# EAGLE schematic dw8e (EAGLE 6.6.0)

## Sheet 1 of 10
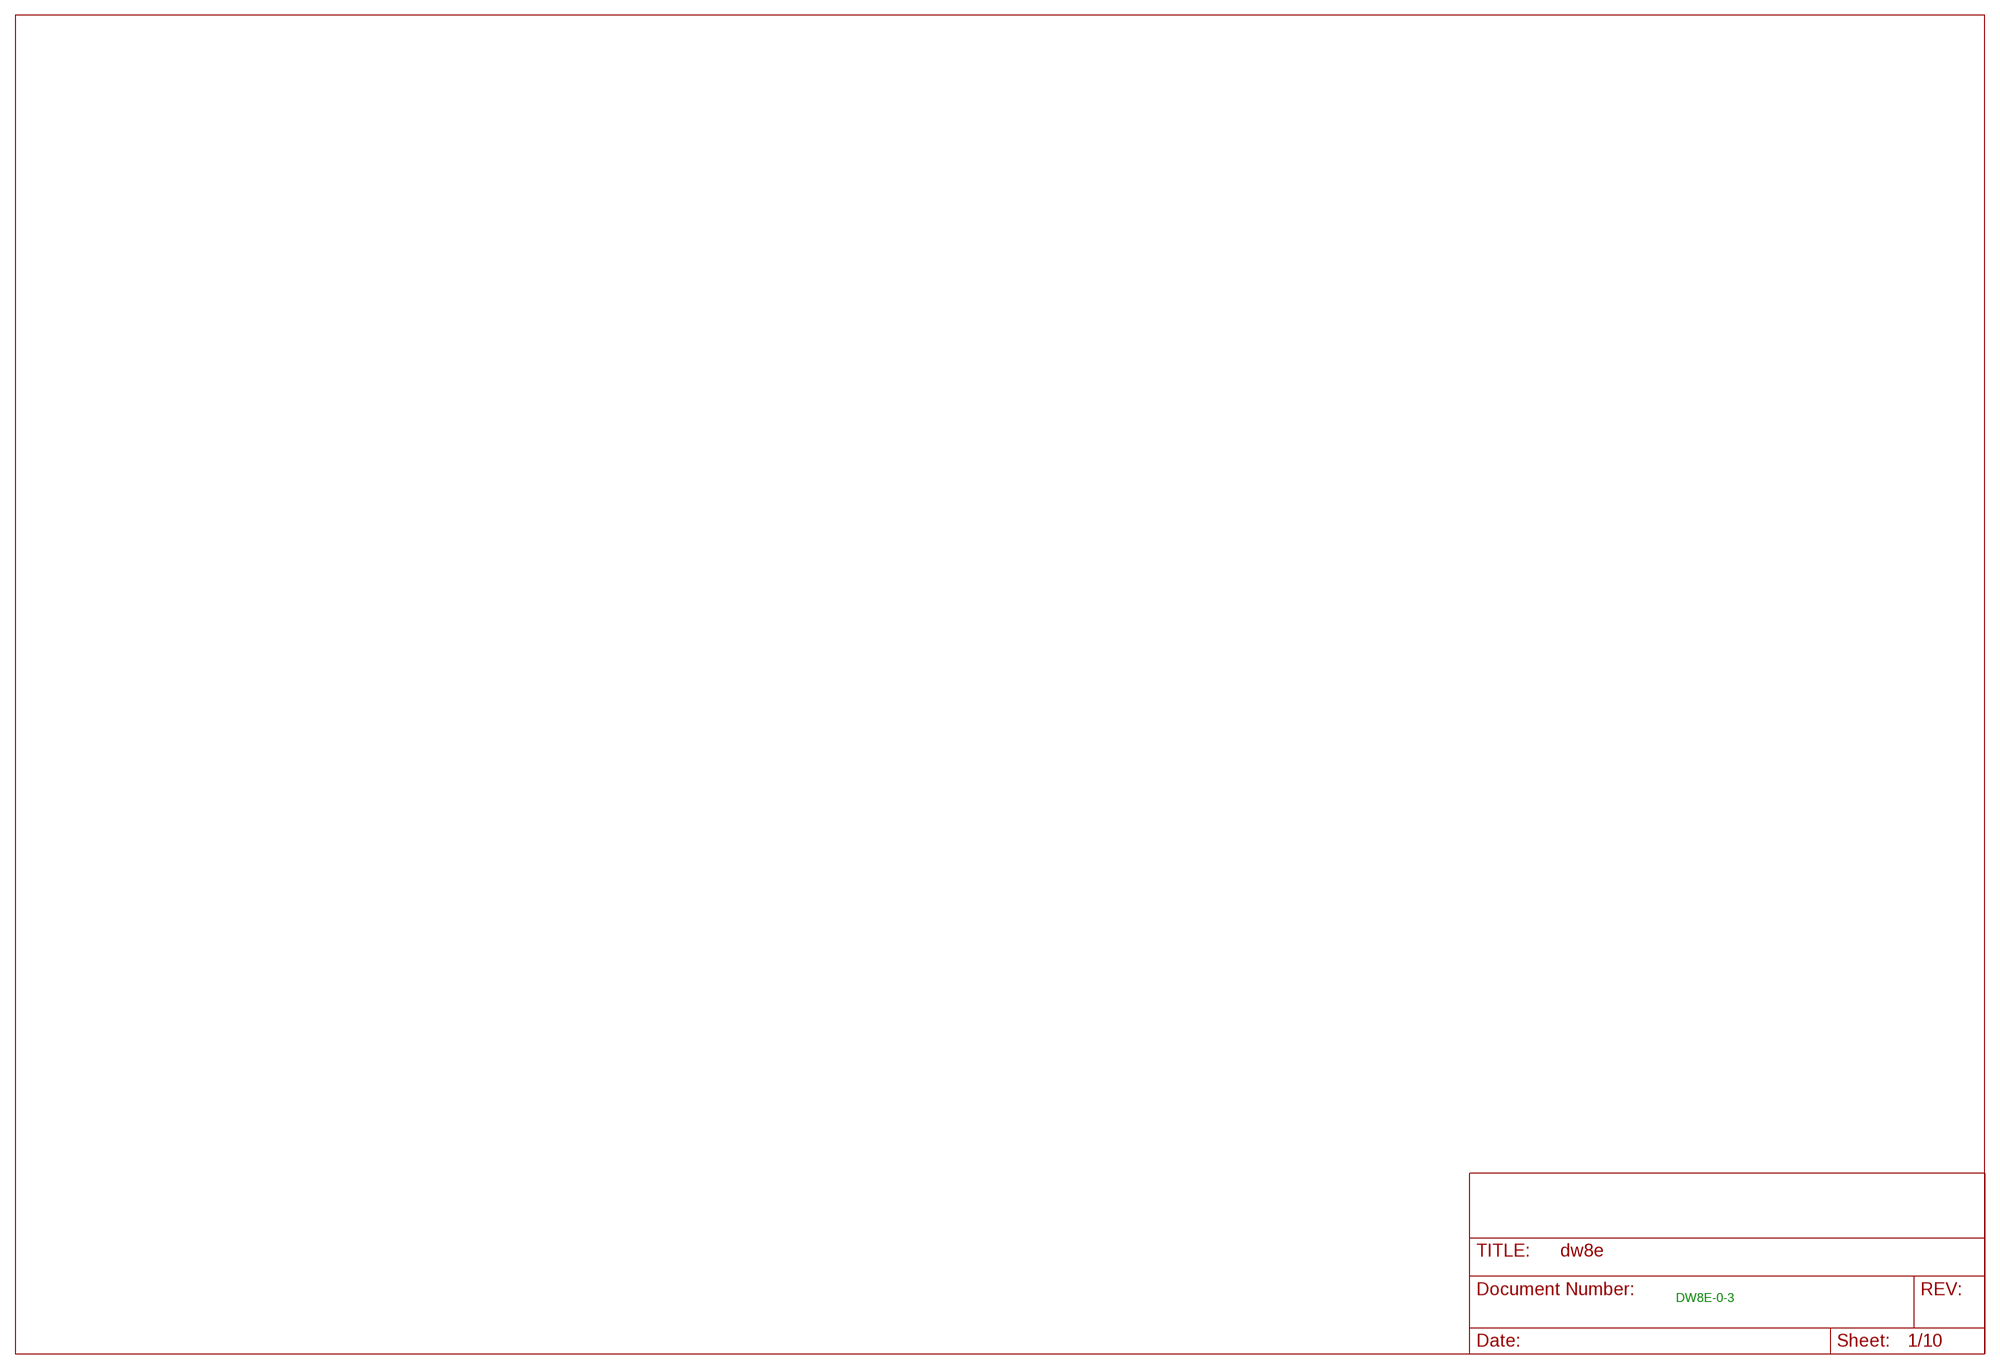
[diagram p0: schematic, sheet 1]

### Notes on the sheet
- DW8E-0-3

## Sheet 2 of 10
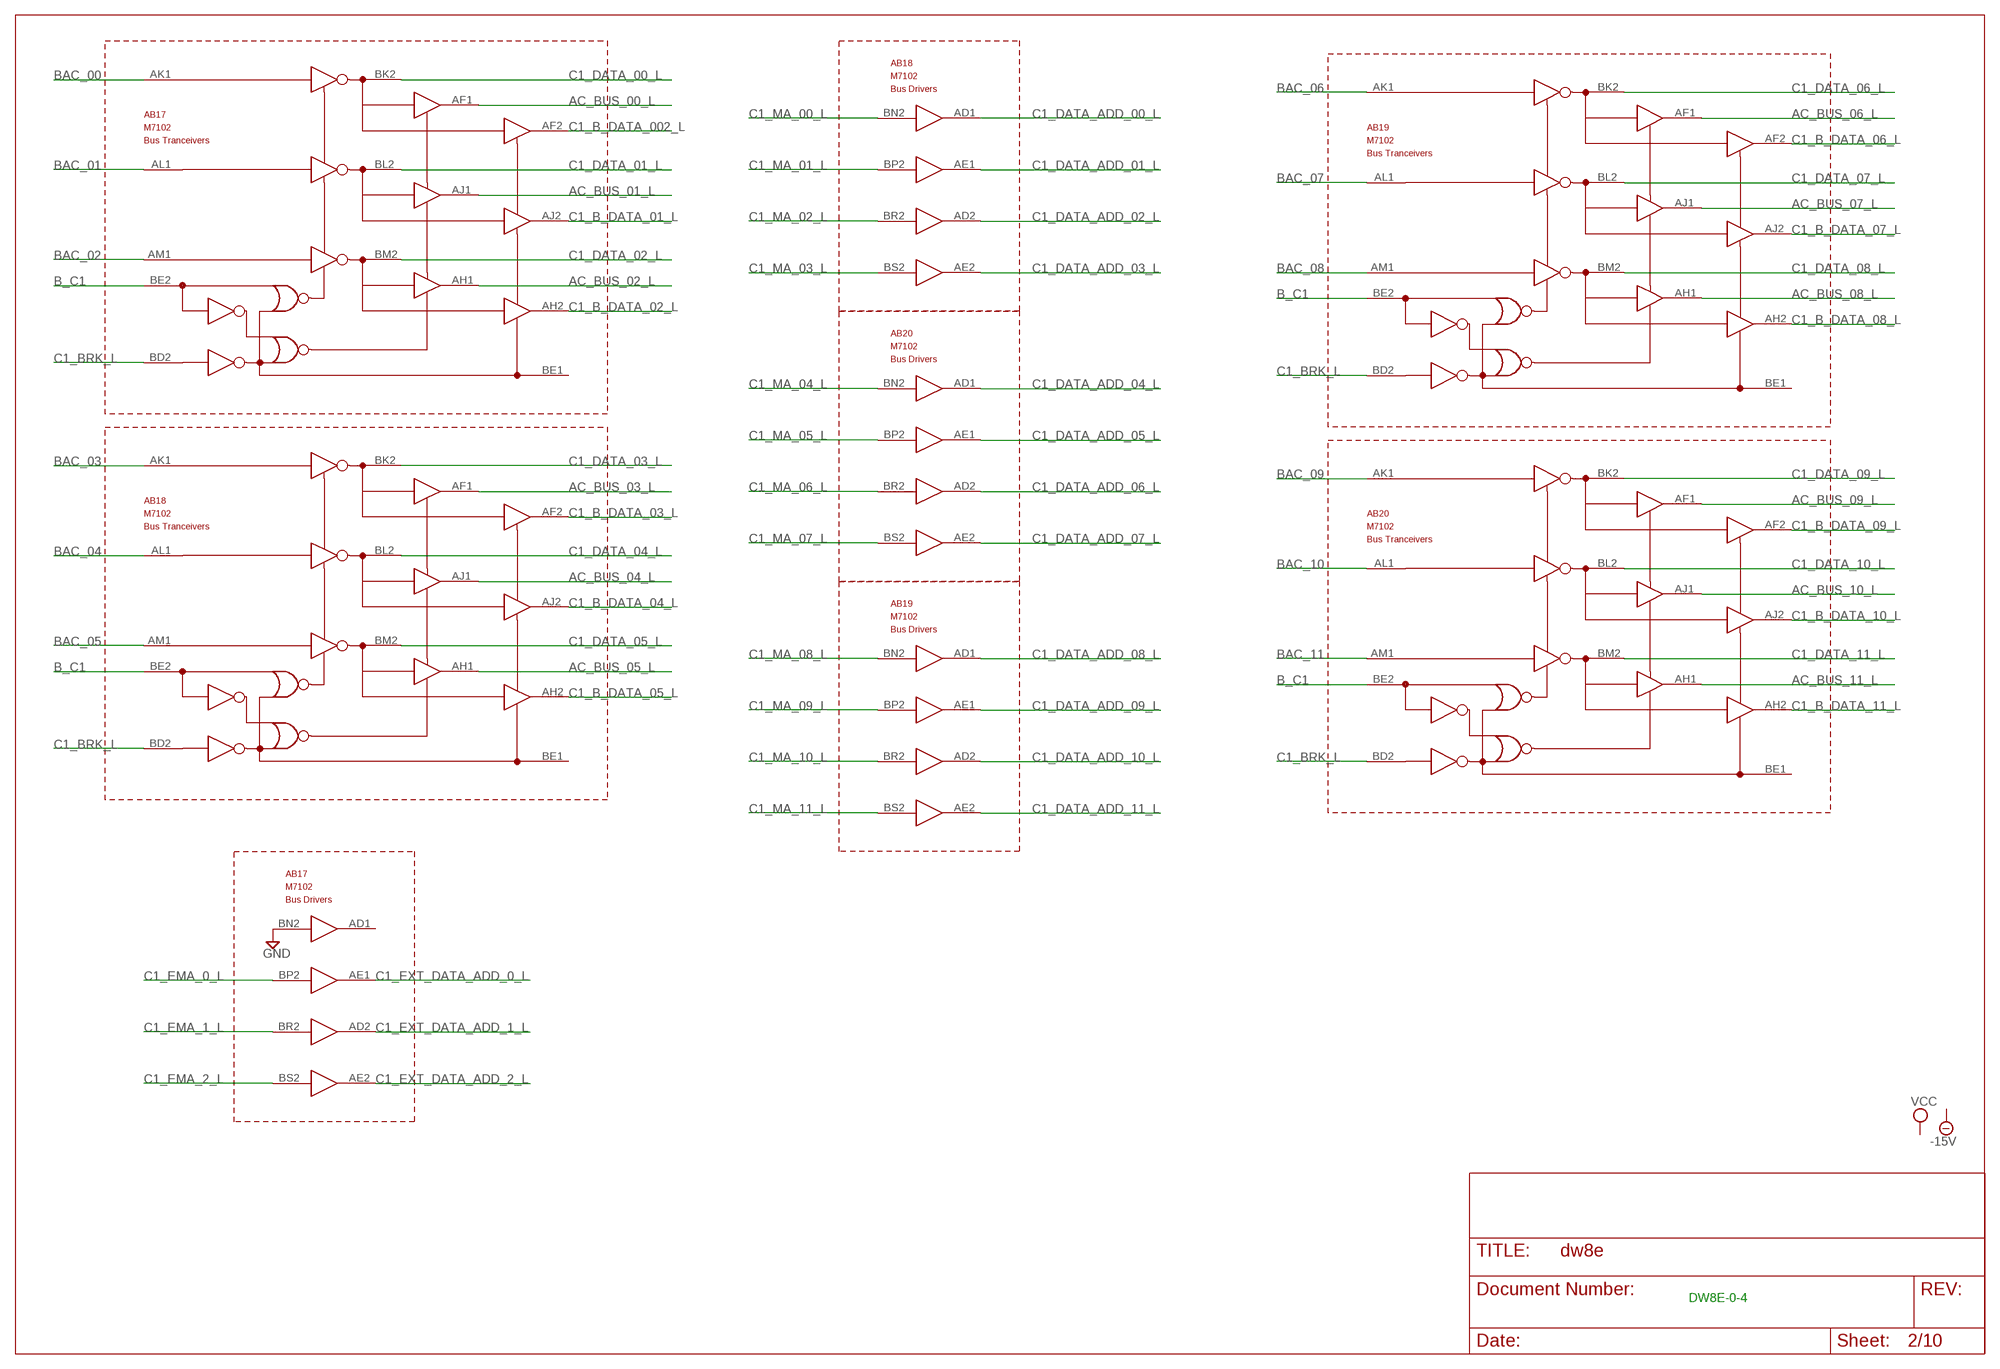
[diagram p1: schematic, sheet 2]

### Parts
AB17  M7102  [H807-2]
AB18  M7102  [H807-2]
AB19  M7102  [H807-2]
AB20  M7102  [H807-2]

### Nets
AC_BUS_00_L: AB17.AF1
AC_BUS_01_L: AB17.AJ1
AC_BUS_02_L: AB17.AH1
AC_BUS_03_L: AB18.AF1
AC_BUS_04_L: AB18.AJ1
AC_BUS_05_L: AB18.AH1
AC_BUS_06_L: AB19.AF1
AC_BUS_07_L: AB19.AJ1
AC_BUS_08_L: AB19.AH1
AC_BUS_09_L: AB20.AF1
AC_BUS_10_L: AB20.AJ1
AC_BUS_11_L: AB20.AH1
B_C1: AB17.BE2 AB18.BE2 AB19.BE2 AB20.BE2
BAC_00: AB17.AK1 ; also sheet 9
BAC_01: AB17.AL1 ; also sheet 9
BAC_02: AB17.AM1 ; also sheet 9
BAC_03: AB18.AK1 ; also sheet 9
BAC_04: AB18.AL1 ; also sheet 9
BAC_05: AB18.AM1 ; also sheet 9
BAC_06: AB19.AK1 ; also sheet 9
BAC_07: AB19.AL1 ; also sheet 9
BAC_08: AB19.AM1 ; also sheet 9
BAC_09: AB20.AK1 ; also sheet 9
BAC_10: AB20.AL1 ; also sheet 9
BAC_11: AB20.AM1 ; also sheet 9
C1_B_DATA_01_L: AB17.AJ2
C1_B_DATA_002_L: AB17.AF2
C1_B_DATA_02_L: AB17.AH2
C1_B_DATA_03_L: AB18.AF2
C1_B_DATA_04_L: AB18.AJ2
C1_B_DATA_05_L: AB18.AH2
C1_B_DATA_06_L: AB19.AF2
C1_B_DATA_07_L: AB19.AJ2
C1_B_DATA_08_L: AB19.AH2
C1_B_DATA_09_L: AB20.AF2
C1_B_DATA_10_L: AB20.AJ2
C1_B_DATA_11_L: AB20.AH2
C1_BRK_L: AB17.BD2 AB18.BD2 AB19.BD2 AB20.BD2 ; also sheet 3
C1_DATA_00_L: AB17.BK2
C1_DATA_01_L: AB17.BL2
C1_DATA_02_L: AB17.BM2
C1_DATA_03_L: AB18.BK2
C1_DATA_04_L: AB18.BL2
C1_DATA_05_L: AB18.BM2
C1_DATA_06_L: AB19.BK2
C1_DATA_07_L: AB19.BL2
C1_DATA_08_L: AB19.BM2
C1_DATA_09_L: AB20.BK2
C1_DATA_10_L: AB20.BL2
C1_DATA_11_L: AB20.BM2
C1_DATA_ADD_00_L: AB18.AD1 ; also sheet 10
C1_DATA_ADD_01_L: AB18.AE1 ; also sheet 10
C1_DATA_ADD_02_L: AB18.AD2 ; also sheet 10
C1_DATA_ADD_03_L: AB18.AE2 ; also sheet 10
C1_DATA_ADD_04_L: AB20.AD1 ; also sheet 10
C1_DATA_ADD_05_L: AB20.AE1 ; also sheet 10
C1_DATA_ADD_06_L: AB20.AD2 ; also sheet 10
C1_DATA_ADD_07_L: AB20.AE2 ; also sheet 10
C1_DATA_ADD_08_L: AB19.AD1 ; also sheet 10
C1_DATA_ADD_09_L: AB19.AE1 ; also sheet 10
C1_DATA_ADD_10_L: AB19.AD2 ; also sheet 10
C1_DATA_ADD_11_L: AB19.AE2 ; also sheet 10
C1_EMA_0_L: AB17.BP2
C1_EMA_1_L: AB17.BR2
C1_EMA_2_L: AB17.BS2
C1_EXT_DATA_ADD_0_L: AB17.AE1 ; also sheet 10
C1_EXT_DATA_ADD_1_L: AB17.AD2 ; also sheet 10
C1_EXT_DATA_ADD_2_L: AB17.AE2 ; also sheet 10
C1_MA_00_L: AB18.BN2
C1_MA_01_L: AB18.BP2
C1_MA_02_L: AB18.BR2
C1_MA_03_L: AB18.BS2
C1_MA_04_L: AB20.BN2
C1_MA_05_L: AB20.BP2
C1_MA_06_L: AB20.BR2
C1_MA_07_L: AB20.BS2
C1_MA_08_L: AB19.BN2
C1_MA_09_L: AB19.BP2
C1_MA_10_L: AB19.BR2
C1_MA_11_L: AB19.BS2
GND: AB17.BN2 ; also sheet 3,4
Unconnected: AB17.AD1 AB17.BE1 AB18.BE1 AB19.BE1 AB20.BE1

### Notes on the sheet
- DW8E-0-4

## Sheet 3 of 10
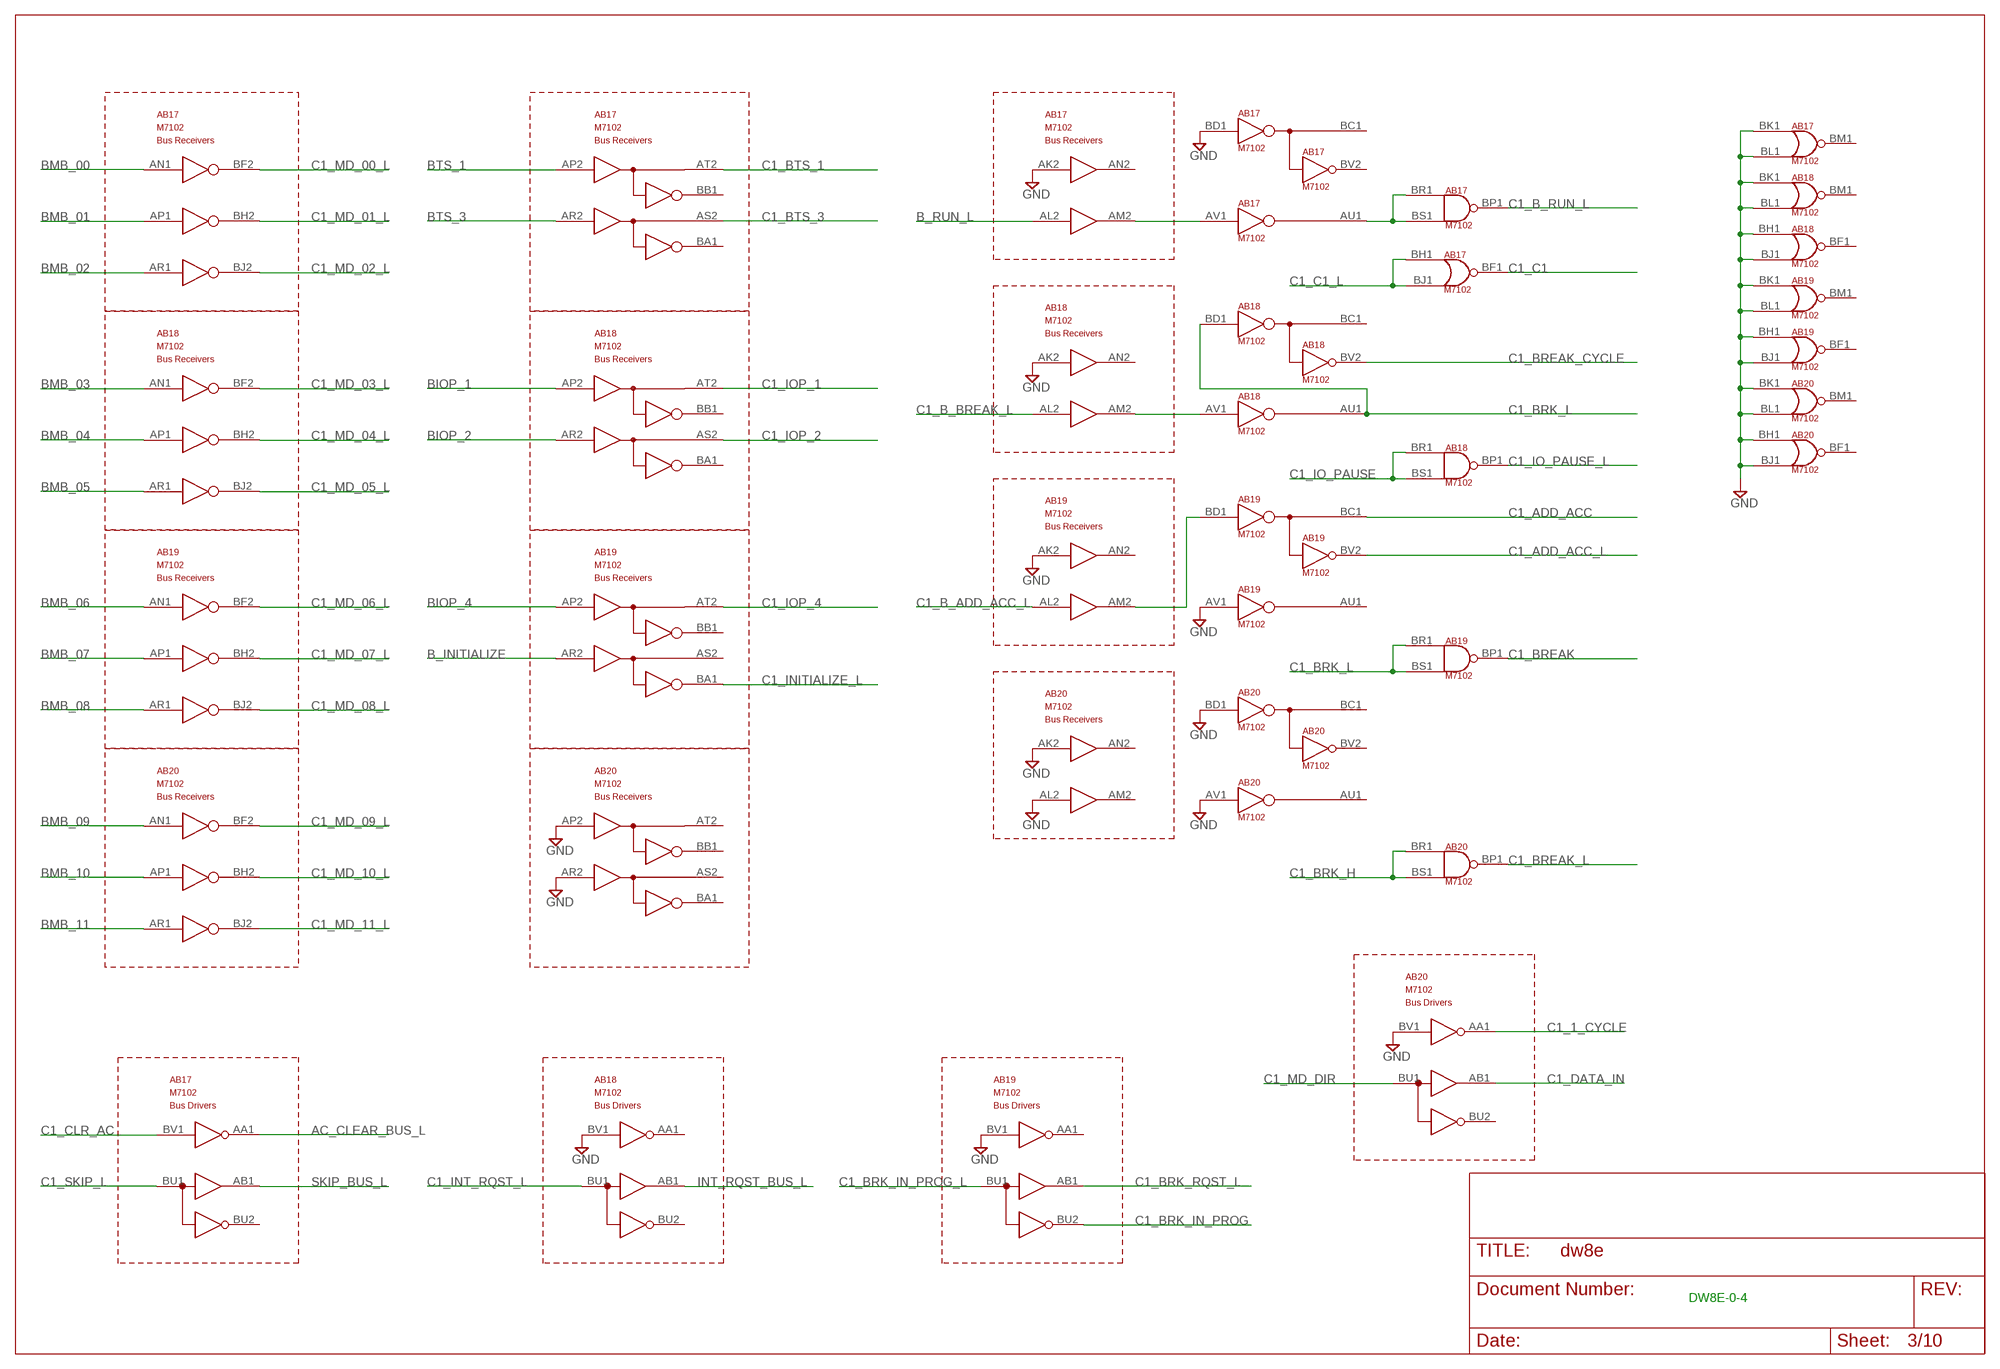
[diagram p2: schematic, sheet 3]

### Nets
AC_CLEAR_BUS_L: AB17.AA1 ; also sheet 9
B_INITIALIZE: AB19.AR2 ; also sheet 9
B_RUN_L: AB17.AL2 ; also sheet 4,9
BIOP_1: AB18.AP2
BIOP_2: AB18.AR2
BIOP_4: AB19.AP2
BMB_00: AB17.AN1 ; also sheet 9
BMB_01: AB17.AP1 ; also sheet 9
BMB_02: AB17.AR1 ; also sheet 9
BMB_03: AB18.AN1 ; also sheet 9
BMB_04: AB18.AP1 ; also sheet 9
BMB_05: AB18.AR1 ; also sheet 9
BMB_06: AB19.AN1 ; also sheet 9
BMB_07: AB19.AP1 ; also sheet 9
BMB_08: AB19.AR1 ; also sheet 9
BMB_09: AB20.AN1 ; also sheet 9
BMB_10: AB20.AP1 ; also sheet 9
BMB_11: AB20.AR1 ; also sheet 9
BTS_1: AB17.AP2 ; also sheet 9
BTS_3: AB17.AR2 ; also sheet 9
C1_1_CYCLE: AB20.AA1 ; also sheet 10
C1_ADD_ACC: AB19.BC1
C1_ADD_ACC_L: AB19.BV2
C1_B_ADD_ACC_L: AB19.AL2
C1_B_BREAK_L: AB18.AL2 ; also sheet 10
C1_B_RUN_L: AB17.BP1(NAND:OUT)
C1_BREAK: AB19.BP1(NAND:OUT)
C1_BREAK_CYCLE: AB18.BV2
C1_BREAK_L: AB20.BP1(NAND:OUT)
C1_BRK_H: AB20.BR1(NAND:IN1) AB20.BS1(NAND:IN2)
C1_BRK_IN_PROG: AB19.BU2
C1_BRK_IN_PROG_L: AB19.BU1
C1_BRK_L: AB18.AU1 AB18.BD1 AB19.BR1(NAND:IN1) AB19.BS1(NAND:IN2) ; also sheet 2
C1_BRK_RQST_L: AB19.AB1 ; also sheet 10
C1_BTS_1: AB17.AT2
C1_BTS_3: AB17.AS2
C1_C1: AB17.BF1(NOR2:OUT)
C1_C1_L: AB17.BH1(NOR2:IN1) AB17.BJ1(NOR2:IN2)
C1_CLR_AC: AB17.BV1
C1_DATA_IN: AB20.AB1 ; also sheet 10
C1_INITIALIZE_L: AB19.BA1
C1_INT_RQST_L: AB18.BU1
C1_IO_PAUSE: AB18.BR1(NAND:IN1) AB18.BS1(NAND:IN2)
C1_IO_PAUSE_L: AB18.BP1(NAND:OUT)
C1_IOP_1: AB18.AT2
C1_IOP_2: AB18.AS2
C1_IOP_4: AB19.AT2
C1_MD_00_L: AB17.BF2
C1_MD_01_L: AB17.BH2
C1_MD_02_L: AB17.BJ2
C1_MD_03_L: AB18.BF2
C1_MD_04_L: AB18.BH2
C1_MD_05_L: AB18.BJ2
C1_MD_06_L: AB19.BF2
C1_MD_07_L: AB19.BH2
C1_MD_08_L: AB19.BJ2
C1_MD_09_L: AB20.BF2
C1_MD_10_L: AB20.BH2
C1_MD_11_L: AB20.BJ2
C1_MD_DIR: AB20.BU1
C1_SKIP_L: AB17.BU1
GND: AB17.AK2 AB17.BD1 AB17.BK1(NOR1:IN1) AB17.BL1(NOR1:IN2) AB18.AK2 AB18.BH1(NOR2:IN1) AB18.BJ1(NOR2:IN2) AB18.BK1(NOR1:IN1) AB18.BL1(NOR1:IN2) AB18.BV1 AB19.AK2 AB19.AV1 AB19.BH1(NOR2:IN1) AB19.BJ1(NOR2:IN2) AB19.BK1(NOR1:IN1) AB19.BL1(NOR1:IN2) AB19.BV1 AB20.AK2 AB20.AL2 AB20.AP2 AB20.AR2 AB20.AV1 AB20.BD1 AB20.BH1(NOR2:IN1) AB20.BJ1(NOR2:IN2) AB20.BK1(NOR1:IN1) AB20.BL1(NOR1:IN2) AB20.BV1 ; also sheet 2,4
INT_RQST_BUS_L: AB18.AB1 ; also sheet 9
N$1: AB17.AU1 AB17.BR1(NAND:IN1) AB17.BS1(NAND:IN2)
N$2: AB19.AM2 AB19.BD1
N$3: AB18.AM2 AB18.AV1
N$4: AB17.AM2 AB17.AV1
SKIP_BUS_L: AB17.AB1 ; also sheet 9
Unconnected: AB17.AN2 AB17.BA1 AB17.BB1 AB17.BC1 AB17.BM1(NOR1:OUT) AB17.BU2 AB17.BV2 AB18.AA1 AB18.AN2 AB18.BA1 AB18.BB1 AB18.BC1 AB18.BF1(NOR2:OUT) AB18.BM1(NOR1:OUT) AB18.BU2 AB19.AA1 AB19.AN2 AB19.AS2 AB19.AU1 AB19.BB1 AB19.BF1(NOR2:OUT) AB19.BM1(NOR1:OUT) AB20.AM2 AB20.AN2 AB20.AS2 AB20.AT2 AB20.AU1 AB20.BA1 AB20.BB1 AB20.BC1 AB20.BF1(NOR2:OUT) AB20.BM1(NOR1:OUT) AB20.BU2 AB20.BV2

### Notes on the sheet
- DW8E-0-4

## Sheet 4 of 10
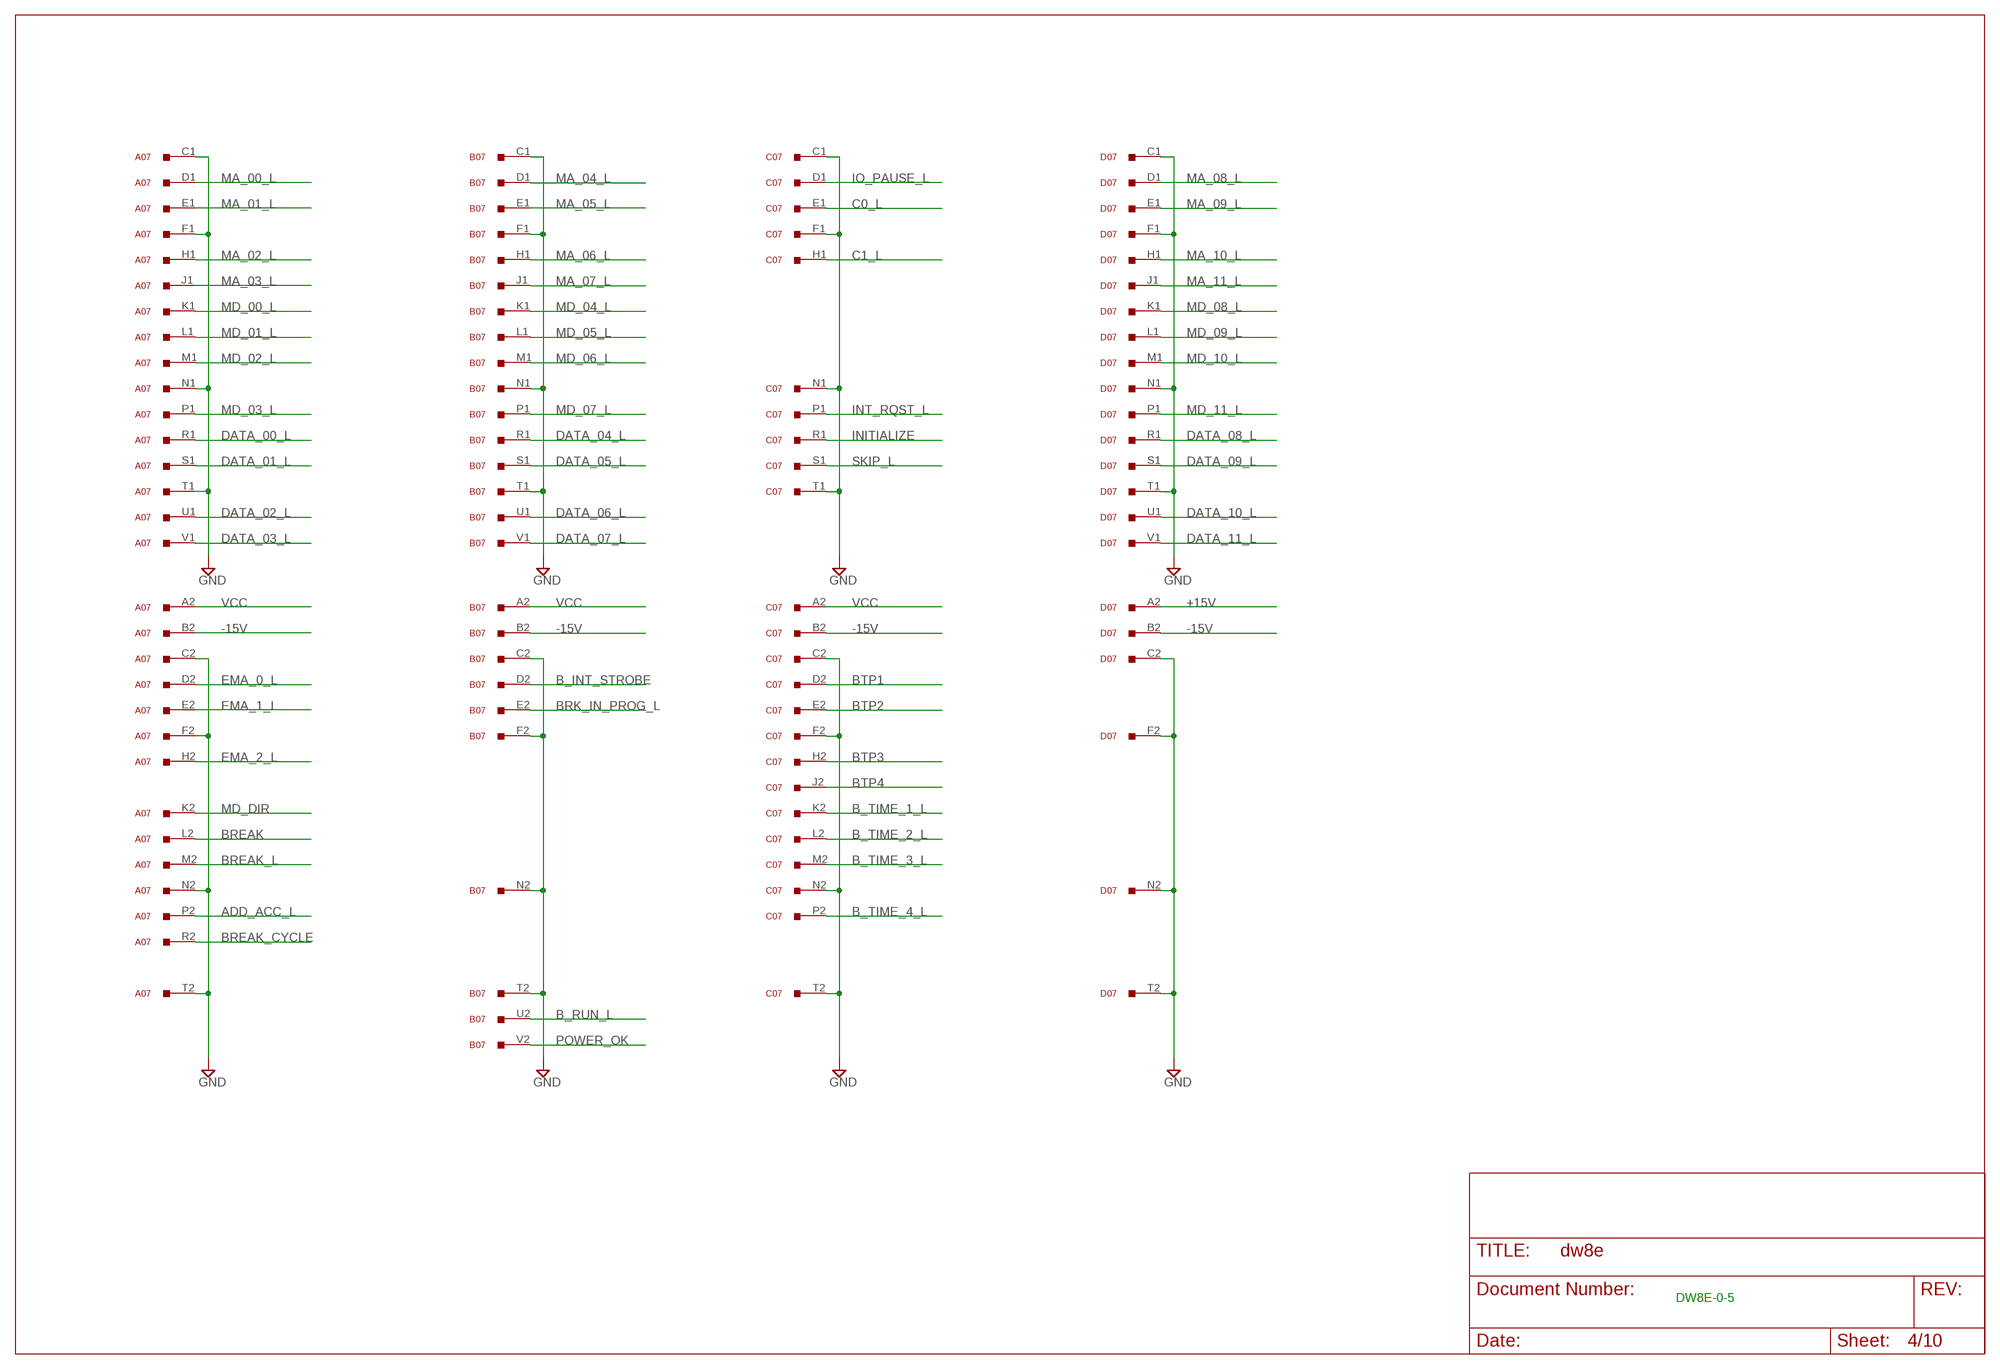
[diagram p3: schematic, sheet 4]

### Parts
A07  M916  [H807]
B07  M916  [H807]
C07  M916  [H807]
D07  M916  [H807]

### Nets
+15V [Supply]: D07.A2
-15V [Supply]: A07.B2 B07.B2 C07.B2 D07.B2
ADD_ACC_L: A07.P2
B_INT_STROBE: B07.D2
B_RUN_L: B07.U2 ; also sheet 3,9
B_TIME_1_L: C07.K2
B_TIME_2_L: C07.L2
B_TIME_3_L: C07.M2
B_TIME_4_L: C07.P2
BREAK: A07.L2
BREAK_CYCLE: A07.R2
BREAK_L: A07.M2
BRK_IN_PROG_L: B07.E2
BTP1: C07.D2
BTP2: C07.E2
BTP3: C07.H2
BTP4: C07.J2
C0_L: C07.E1
C1_L: C07.H1
DATA_00_L: A07.R1
DATA_01_L: A07.S1
DATA_02_L: A07.U1
DATA_03_L: A07.V1
DATA_04_L: B07.R1
DATA_05_L: B07.S1
DATA_06_L: B07.U1
DATA_07_L: B07.V1
DATA_08_L: D07.R1
DATA_09_L: D07.S1
DATA_10_L: D07.U1
DATA_11_L: D07.V1
EMA_0_L: A07.D2
EMA_1_L: A07.E2
EMA_2_L: A07.H2
GND: A07.C1 A07.C2 A07.F1 A07.F2 A07.N1 A07.N2 A07.T1 A07.T2 B07.C1 B07.C2 B07.F1 B07.F2 B07.N1 B07.N2 B07.T1 B07.T2 C07.C1 C07.C2 C07.F1 C07.F2 C07.N1 C07.N2 C07.T1 C07.T2 D07.C1 D07.C2 D07.F1 D07.F2 D07.N1 D07.N2 D07.T1 D07.T2 ; also sheet 2,3
INITIALIZE: C07.R1
INT_RQST_L: C07.P1
IO_PAUSE_L: C07.D1
MA_00_L: A07.D1
MA_01_L: A07.E1
MA_02_L: A07.H1
MA_03_L: A07.J1
MA_04_L: B07.D1
MA_05_L: B07.E1
MA_06_L: B07.H1
MA_07_L: B07.J1
MA_08_L: D07.D1
MA_09_L: D07.E1
MA_10_L: D07.H1
MA_11_L: D07.J1
MD_00_L: A07.K1
MD_01_L: A07.L1
MD_02_L: A07.M1
MD_03_L: A07.P1
MD_04_L: B07.K1
MD_05_L: B07.L1
MD_06_L: B07.M1
MD_07_L: B07.P1
MD_08_L: D07.K1
MD_09_L: D07.L1
MD_10_L: D07.M1
MD_11_L: D07.P1
MD_DIR: A07.K2
POWER_OK: B07.V2
SKIP_L: C07.S1
VCC [Supply]: A07.A2 B07.A2 C07.A2
Unconnected: A07.A1 A07.B1 A07.J2 A07.S2 A07.U2 A07.V2 B07.A1 B07.B1 B07.H2 B07.J2 B07.K2 B07.L2 B07.M2 B07.P2 B07.R2 B07.S2 C07.A1 C07.B1 C07.J1 C07.K1 C07.L1 C07.M1 C07.R2 C07.S2 C07.U1 C07.U2 C07.V1 C07.V2 D07.A1 D07.B1 D07.D2 D07.E2 D07.H2 D07.J2 D07.K2 D07.L2 D07.M2 D07.P2 D07.R2 D07.S2 D07.U2 D07.V2

### Notes on the sheet
- DW8E-0-5

## Sheet 5 of 10
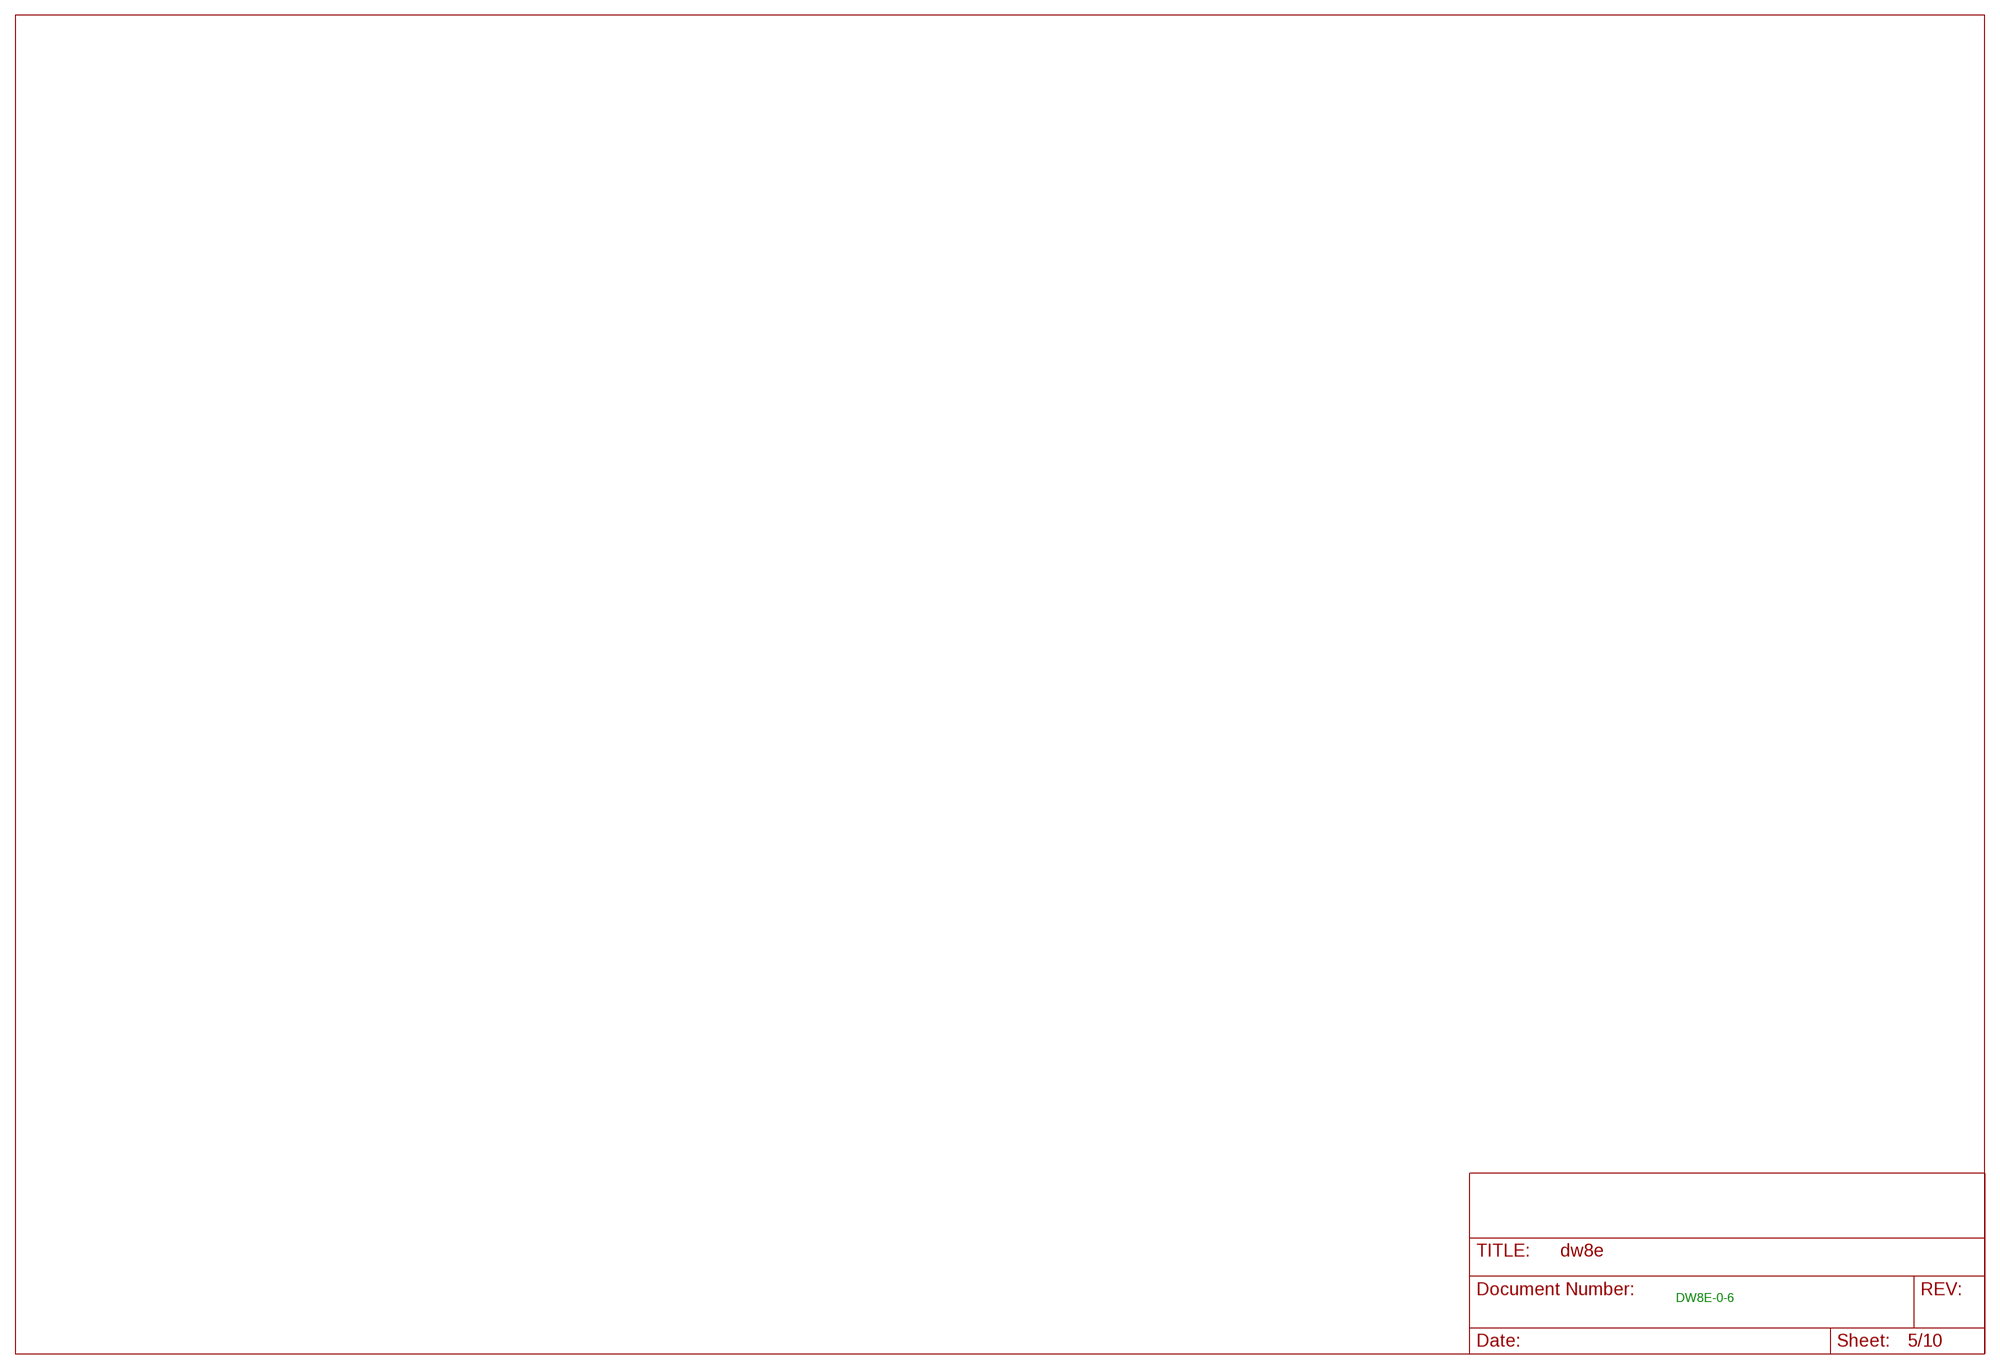
[diagram p4: schematic, sheet 5]

### Notes on the sheet
- DW8E-0-6

## Sheet 6 of 10
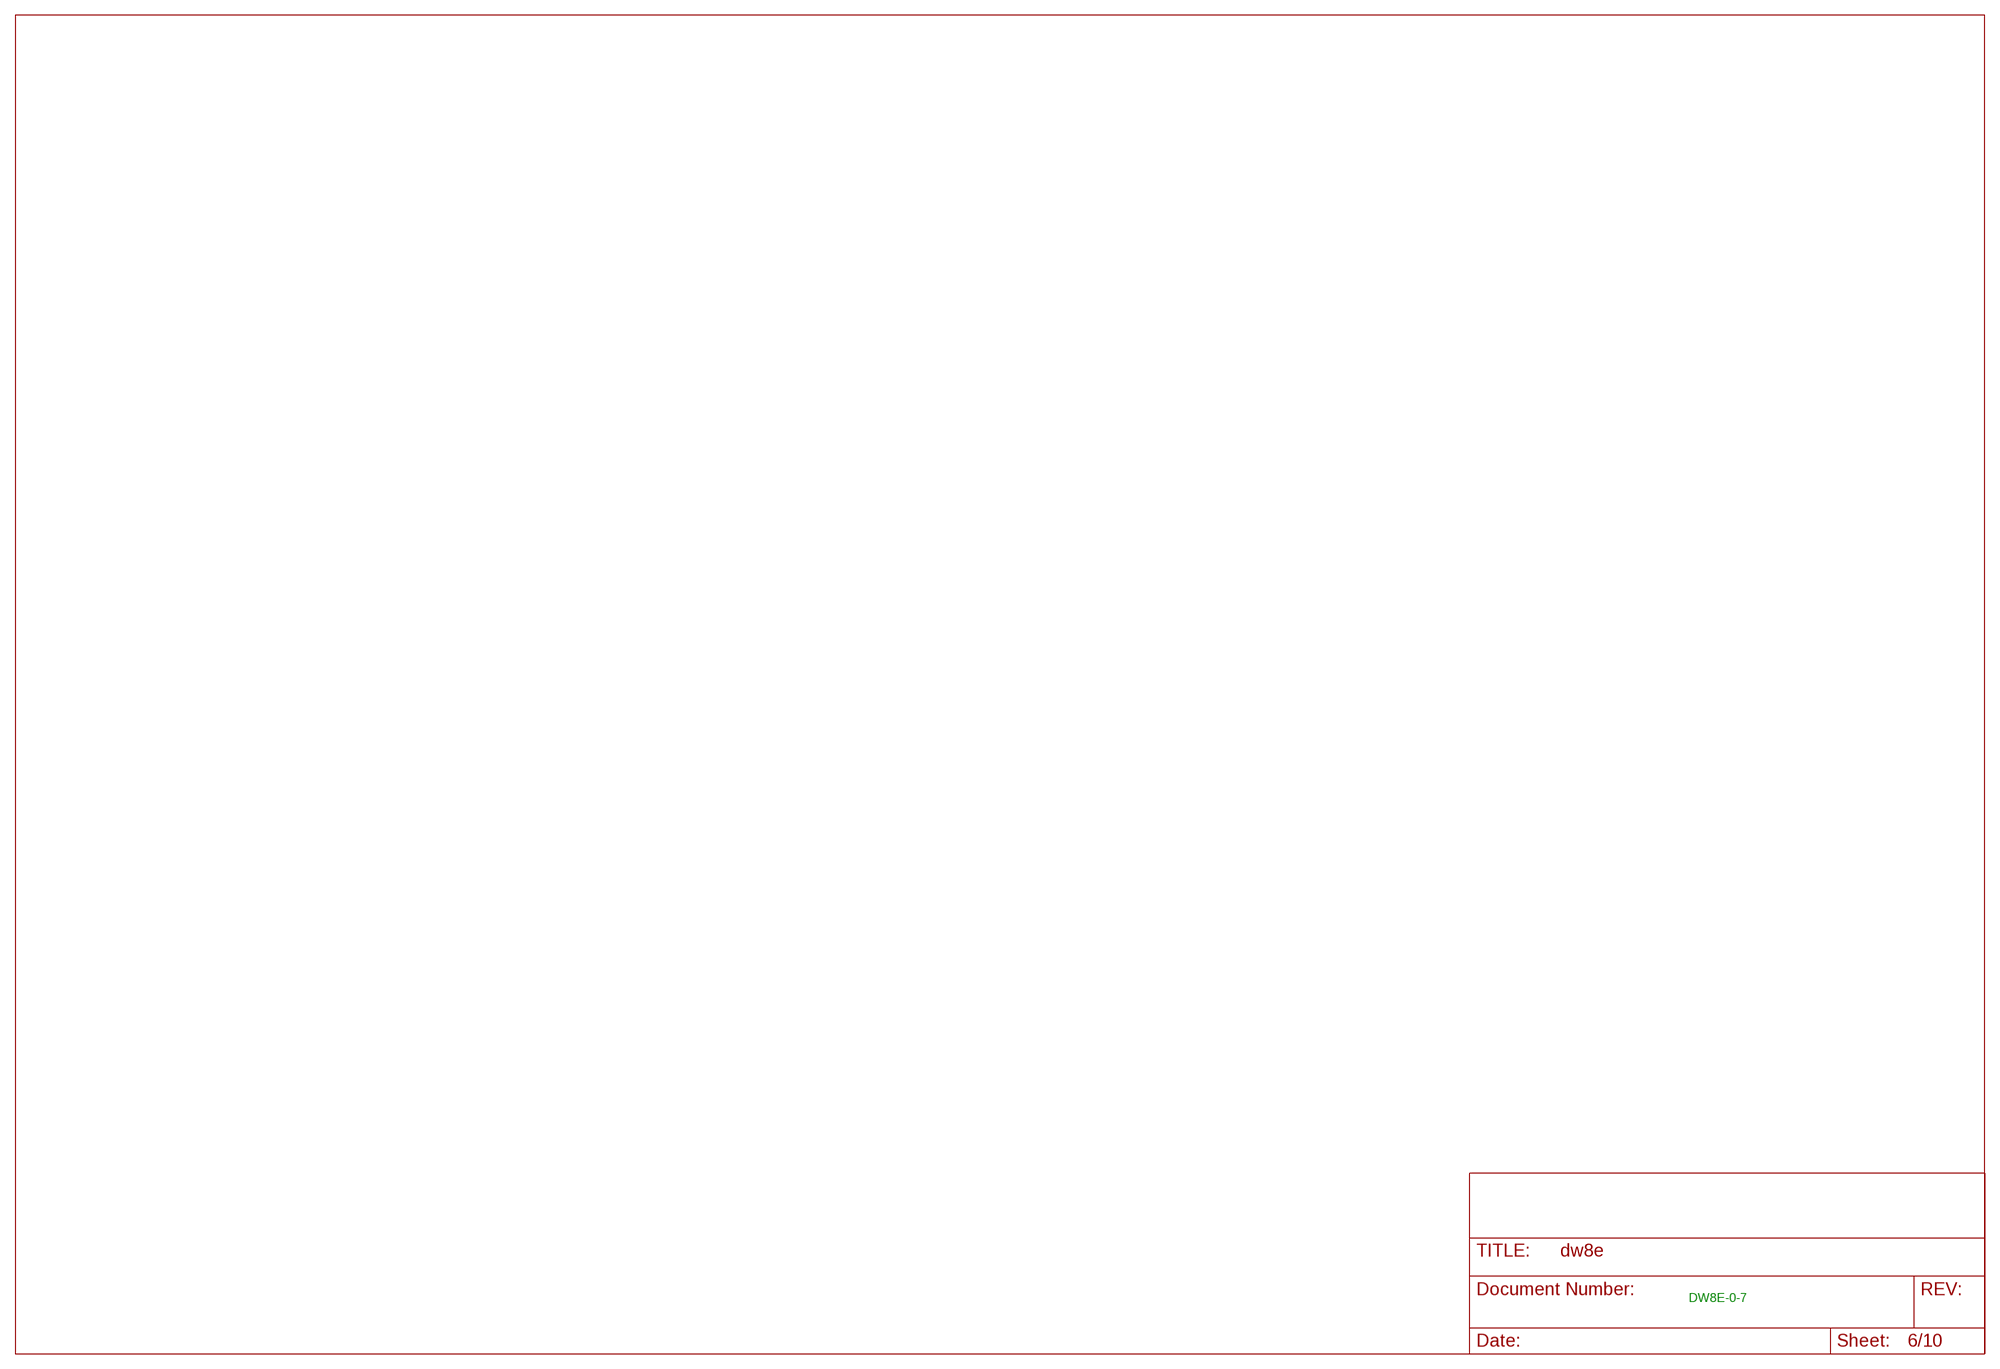
[diagram p5: schematic, sheet 6]

### Notes on the sheet
- DW8E-0-7

## Sheet 7 of 10
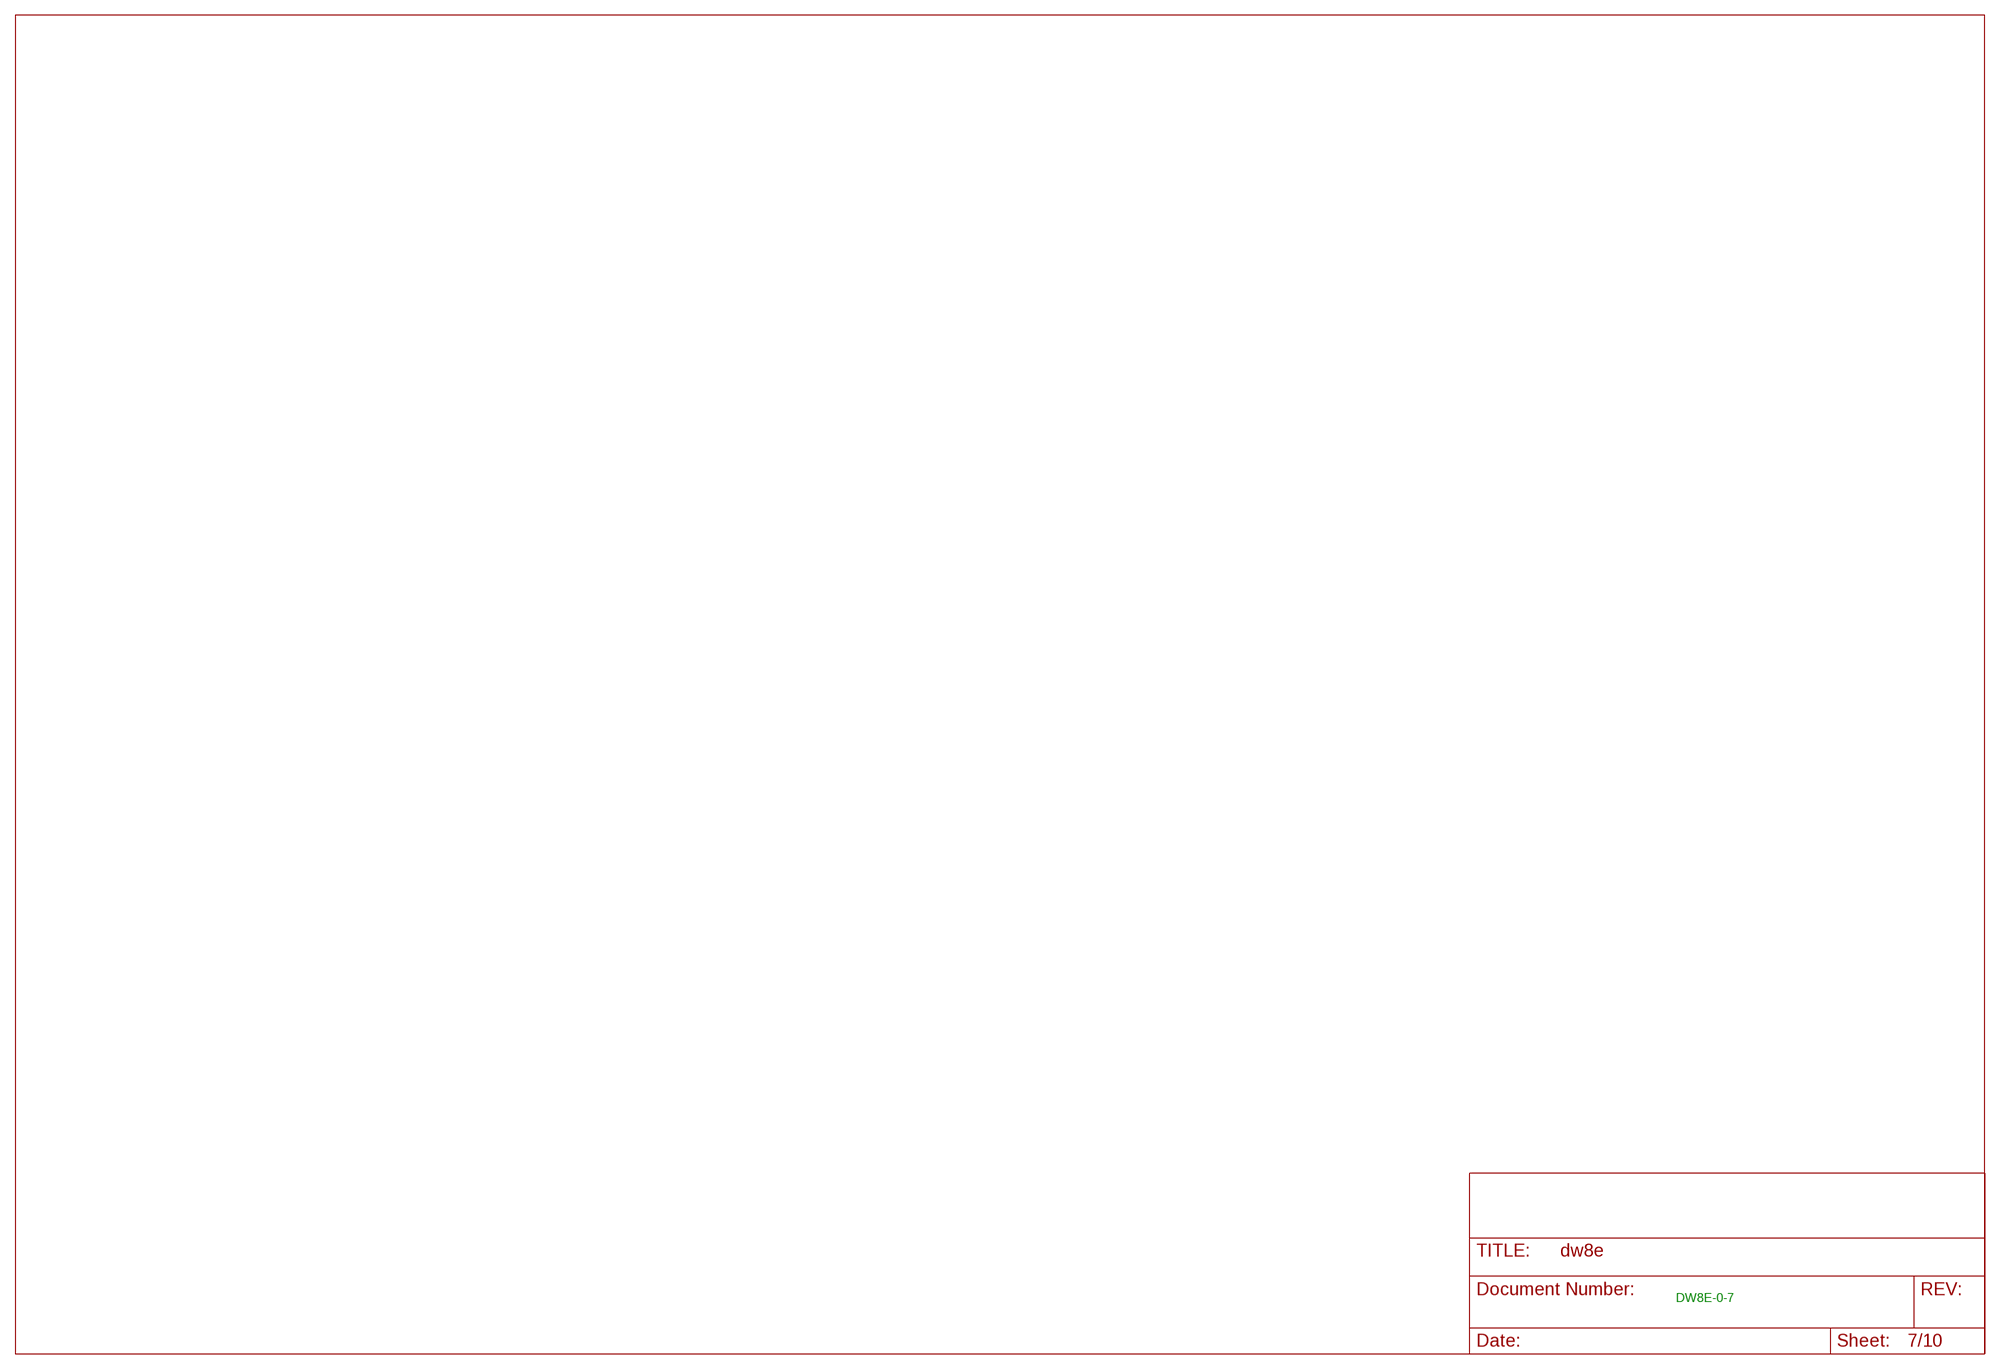
[diagram p6: schematic, sheet 7]

### Notes on the sheet
- DW8E-0-7

## Sheet 8 of 10
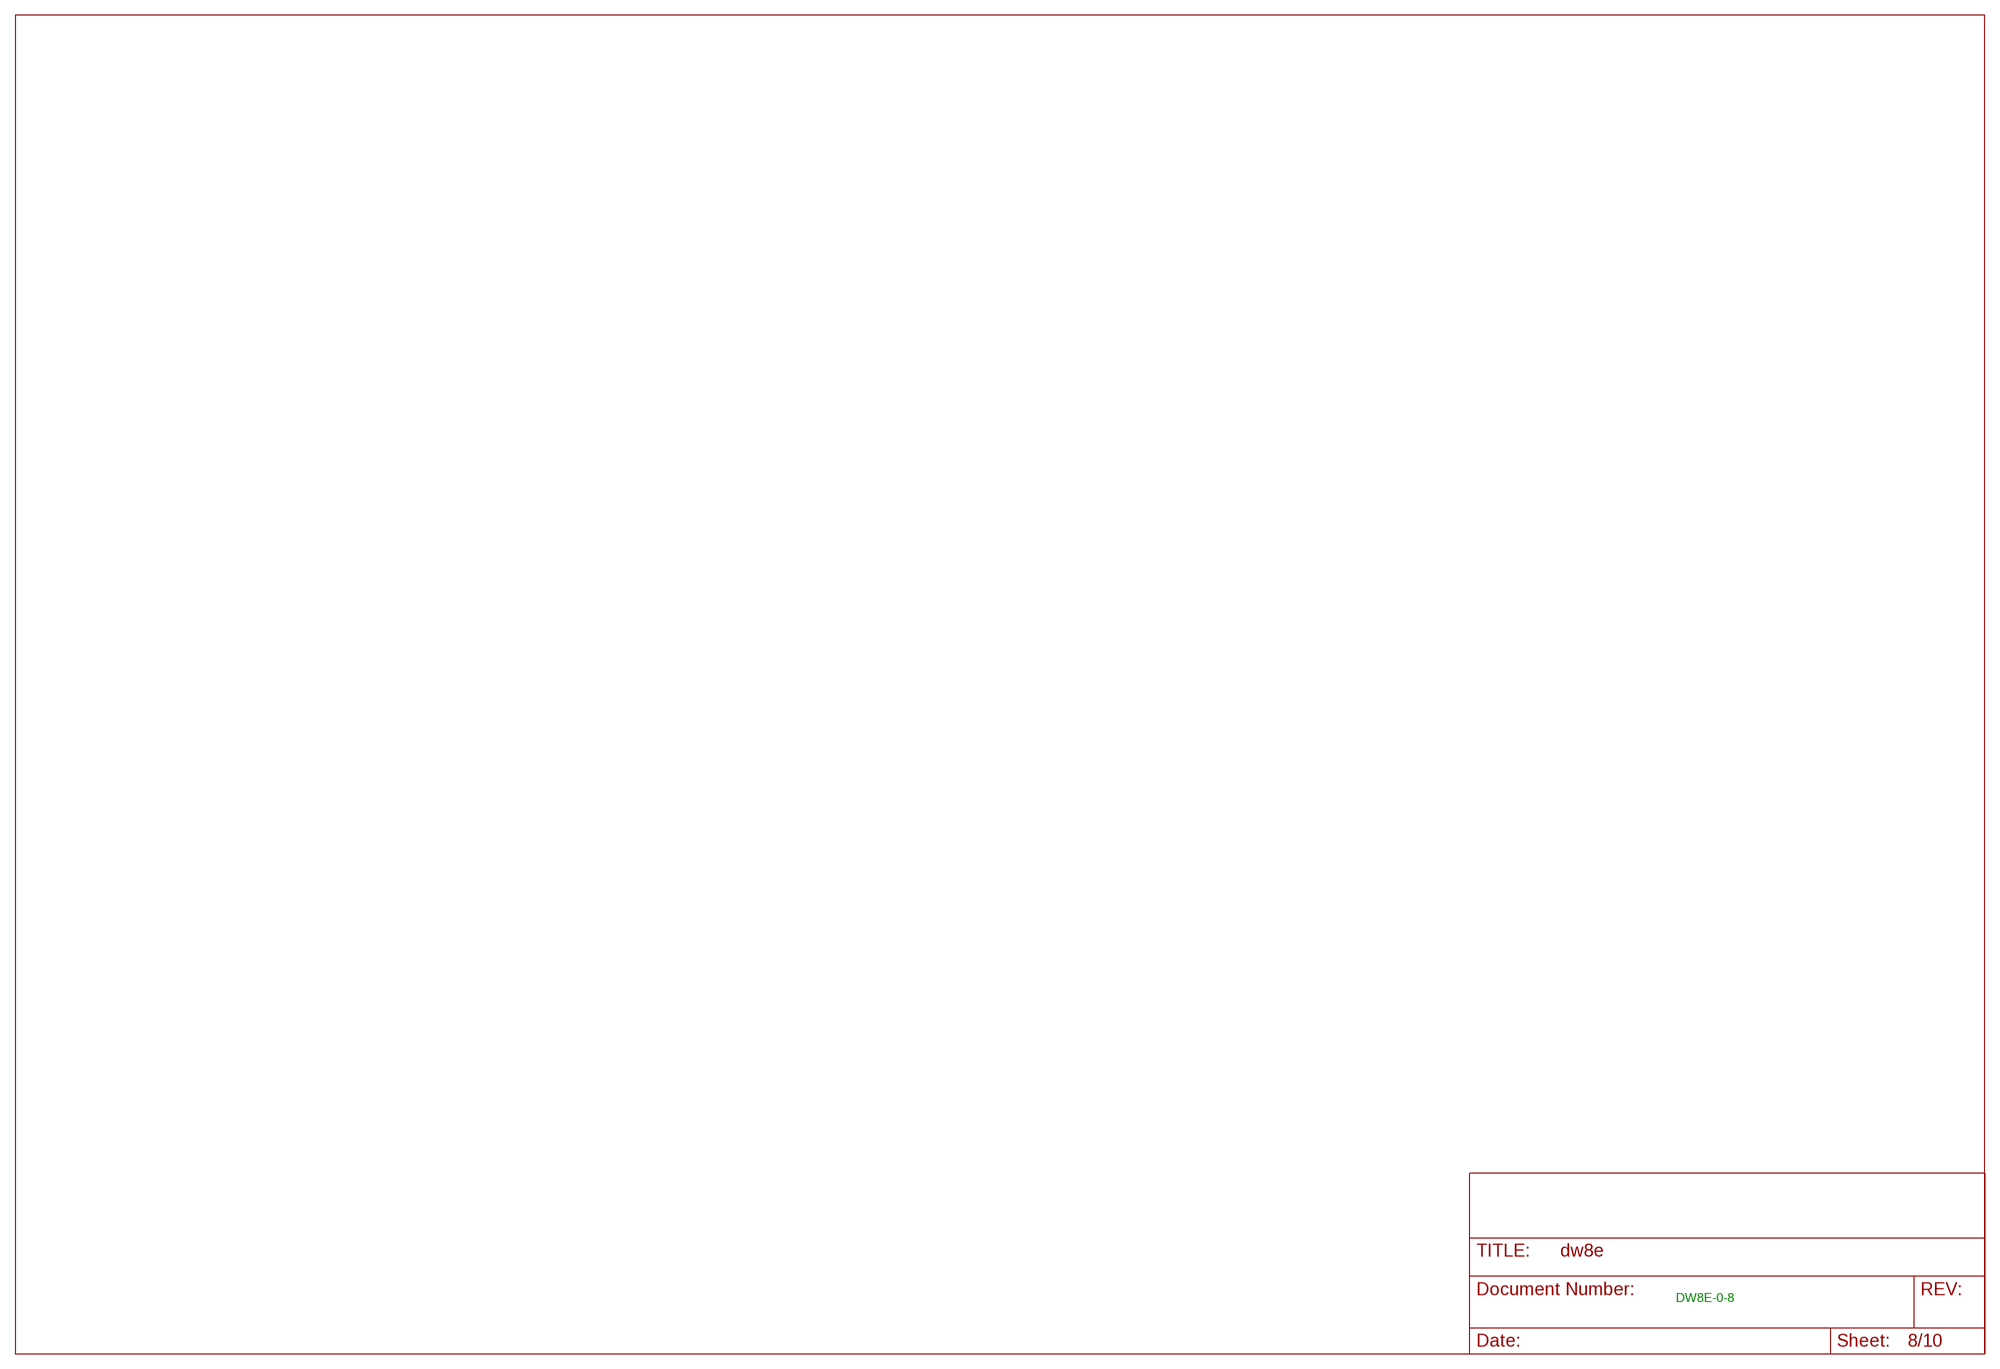
[diagram p7: schematic, sheet 8]

### Notes on the sheet
- DW8E-0-8

## Sheet 9 of 10
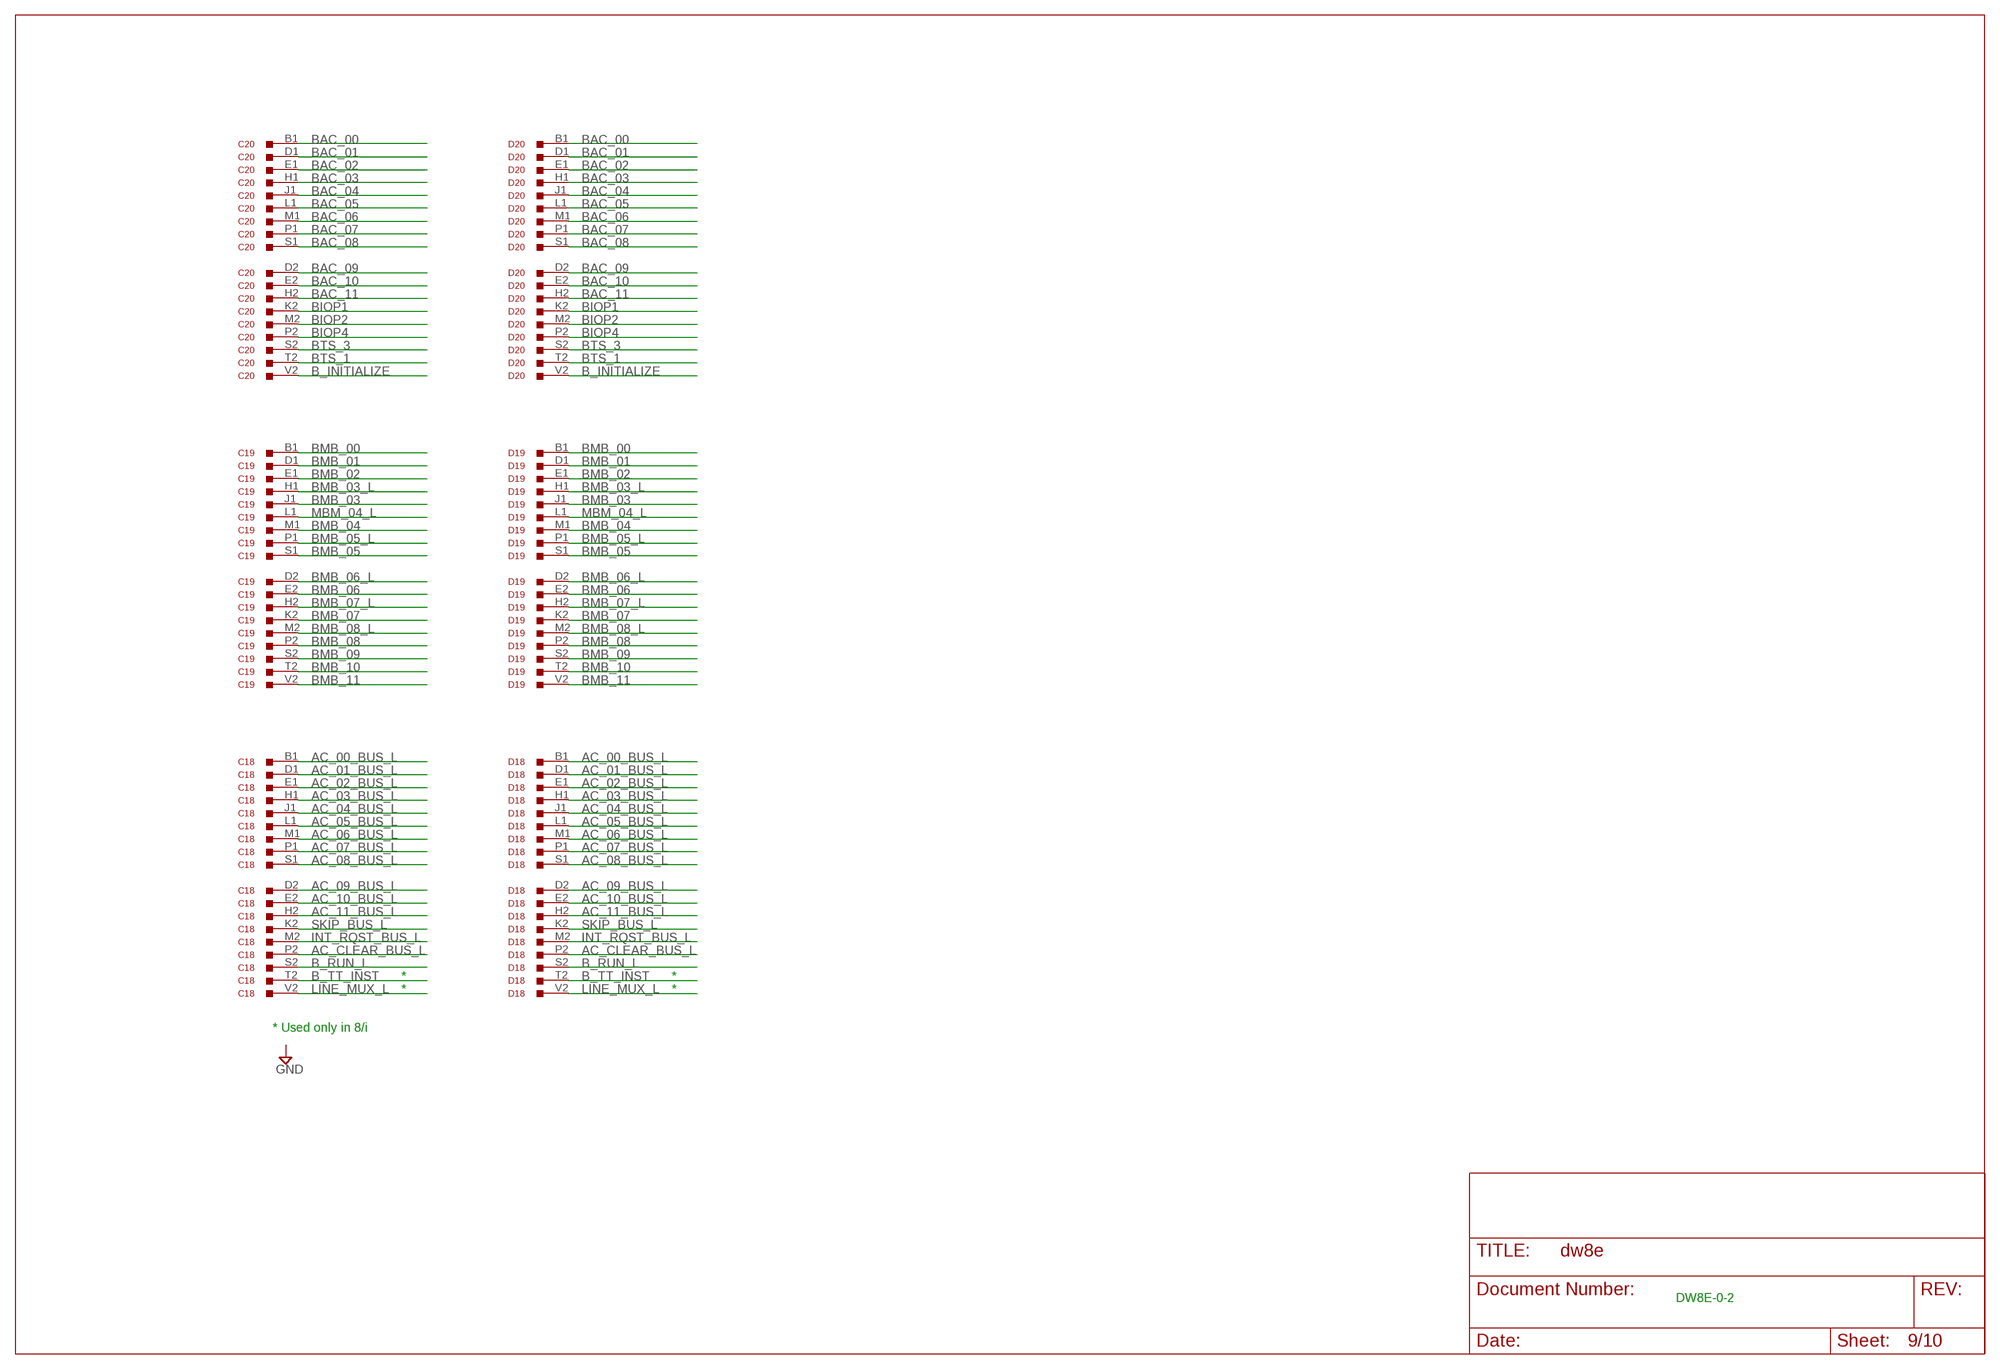
[diagram p8: schematic, sheet 9]

### Parts
C18  M903  [H807]
C19  M903  [H807]
C20  M903  [H807]
D18  M903  [H807]
D19  M903  [H807]
D20  M903  [H807]

### Nets
AC_00_BUS_L: C18.B1 D18.B1
AC_01_BUS_L: C18.D1 D18.D1
AC_02_BUS_L: C18.E1 D18.E1
AC_03_BUS_L: C18.H1 D18.H1
AC_04_BUS_L: C18.J1 D18.J1
AC_05_BUS_L: C18.L1 D18.L1
AC_06_BUS_L: C18.M1 D18.M1
AC_07_BUS_L: C18.P1 D18.P1
AC_08_BUS_L: C18.S1 D18.S1
AC_09_BUS_L: C18.D2 D18.D2
AC_10_BUS_L: C18.E2 D18.E2
AC_11_BUS_L: C18.H2 D18.H2
AC_CLEAR_BUS_L: C18.P2 D18.P2 ; also sheet 3
B_INITIALIZE: C20.V2 D20.V2 ; also sheet 3
B_RUN_L: C18.S2 D18.S2 ; also sheet 3,4
B_TT_INST: C18.T2 D18.T2
BAC_00: C20.B1 D20.B1 ; also sheet 2
BAC_01: C20.D1 D20.D1 ; also sheet 2
BAC_02: C20.E1 D20.E1 ; also sheet 2
BAC_03: C20.H1 D20.H1 ; also sheet 2
BAC_04: C20.J1 D20.J1 ; also sheet 2
BAC_05: C20.L1 D20.L1 ; also sheet 2
BAC_06: C20.M1 D20.M1 ; also sheet 2
BAC_07: C20.P1 D20.P1 ; also sheet 2
BAC_08: C20.S1 D20.S1 ; also sheet 2
BAC_09: C20.D2 D20.D2 ; also sheet 2
BAC_10: C20.E2 D20.E2 ; also sheet 2
BAC_11: C20.H2 D20.H2 ; also sheet 2
BIOP1: C20.K2 D20.K2
BIOP2: C20.M2 D20.M2
BIOP4: C20.P2 D20.P2
BMB_00: C19.B1 D19.B1 ; also sheet 3
BMB_01: C19.D1 D19.D1 ; also sheet 3
BMB_02: C19.E1 D19.E1 ; also sheet 3
BMB_03: C19.J1 D19.J1 ; also sheet 3
BMB_03_L: C19.H1 D19.H1
BMB_04: C19.M1 D19.M1 ; also sheet 3
BMB_05: C19.S1 D19.S1 ; also sheet 3
BMB_05_L: C19.P1 D19.P1
BMB_06: C19.E2 D19.E2 ; also sheet 3
BMB_06_L: C19.D2 D19.D2
BMB_07: C19.K2 D19.K2 ; also sheet 3
BMB_07_L: C19.H2 D19.H2
BMB_08: C19.P2 D19.P2 ; also sheet 3
BMB_08_L: C19.M2 D19.M2
BMB_09: C19.S2 D19.S2 ; also sheet 3
BMB_10: C19.T2 D19.T2 ; also sheet 3
BMB_11: C19.V2 D19.V2 ; also sheet 3
BTS_1: C20.T2 D20.T2 ; also sheet 3
BTS_3: C20.S2 D20.S2 ; also sheet 3
INT_RQST_BUS_L: C18.M2 D18.M2 ; also sheet 3
LINE_MUX_L: C18.V2 D18.V2
MBM_04_L: C19.L1 D19.L1
SKIP_BUS_L: C18.K2 D18.K2 ; also sheet 3

### Notes on the sheet
- * | *
- * | *
- * Used only in 8/i
- DW8E-0-2

## Sheet 10 of 10
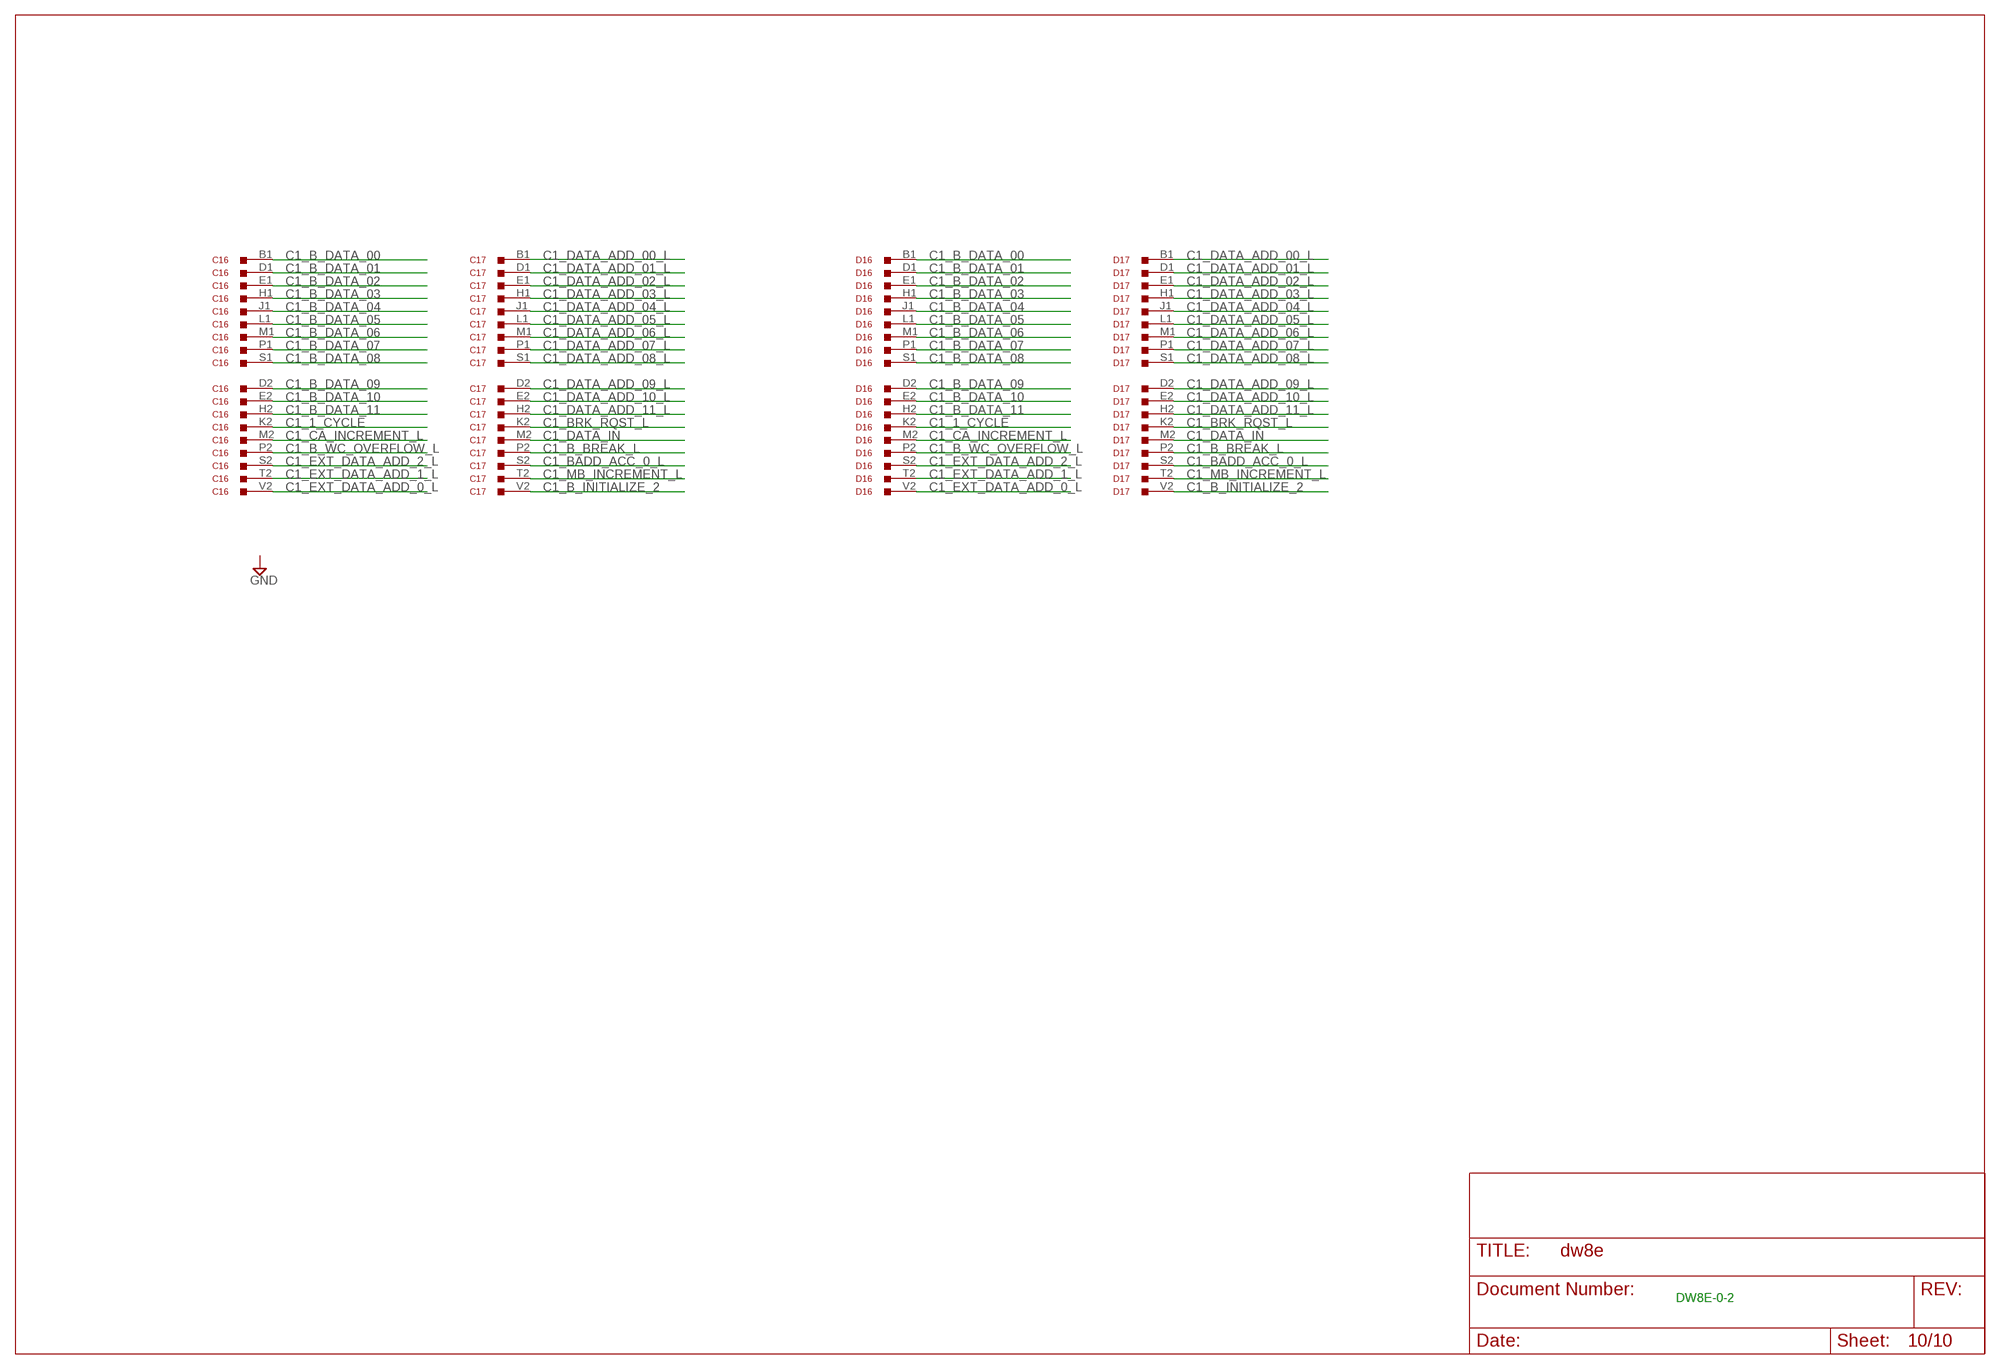
[diagram p9: schematic, sheet 10]

### Parts
C16  M903  [H807]
C17  M903  [H807]
D16  M903  [H807]
D17  M903  [H807]

### Nets
C1_1_CYCLE: C16.K2 D16.K2 ; also sheet 3
C1_B_BREAK_L: C17.P2 D17.P2 ; also sheet 3
C1_B_DATA_00: C16.B1 D16.B1
C1_B_DATA_01: C16.D1 D16.D1
C1_B_DATA_02: C16.E1 D16.E1
C1_B_DATA_03: C16.H1 D16.H1
C1_B_DATA_04: C16.J1 D16.J1
C1_B_DATA_05: C16.L1 D16.L1
C1_B_DATA_06: C16.M1 D16.M1
C1_B_DATA_07: C16.P1 D16.P1
C1_B_DATA_08: C16.S1 D16.S1
C1_B_DATA_09: C16.D2 D16.D2
C1_B_DATA_10: C16.E2 D16.E2
C1_B_DATA_11: C16.H2 D16.H2
C1_B_INITIALIZE_2: C17.V2 D17.V2
C1_B_WC_OVERFLOW_L: C16.P2 D16.P2
C1_BADD_ACC_0_L: C17.S2 D17.S2
C1_BRK_RQST_L: C17.K2 D17.K2 ; also sheet 3
C1_CA_INCREMENT_L: C16.M2 D16.M2
C1_DATA_ADD_00_L: C17.B1 D17.B1 ; also sheet 2
C1_DATA_ADD_01_L: C17.D1 D17.D1 ; also sheet 2
C1_DATA_ADD_02_L: C17.E1 D17.E1 ; also sheet 2
C1_DATA_ADD_03_L: C17.H1 D17.H1 ; also sheet 2
C1_DATA_ADD_04_L: C17.J1 D17.J1 ; also sheet 2
C1_DATA_ADD_05_L: C17.L1 D17.L1 ; also sheet 2
C1_DATA_ADD_06_L: C17.M1 D17.M1 ; also sheet 2
C1_DATA_ADD_07_L: C17.P1 D17.P1 ; also sheet 2
C1_DATA_ADD_08_L: C17.S1 D17.S1 ; also sheet 2
C1_DATA_ADD_09_L: C17.D2 D17.D2 ; also sheet 2
C1_DATA_ADD_10_L: C17.E2 D17.E2 ; also sheet 2
C1_DATA_ADD_11_L: C17.H2 D17.H2 ; also sheet 2
C1_DATA_IN: C17.M2 D17.M2 ; also sheet 3
C1_EXT_DATA_ADD_0_L: C16.V2 D16.V2 ; also sheet 2
C1_EXT_DATA_ADD_1_L: C16.T2 D16.T2 ; also sheet 2
C1_EXT_DATA_ADD_2_L: C16.S2 D16.S2 ; also sheet 2
C1_MB_INCREMENT_L: C17.T2 D17.T2

### Notes on the sheet
- DW8E-0-2

## Power pins joined to a net without a drawn wire
-15V: AB17.AB2(-15V) AB17.BB2(-15V) AB18.AB2(-15V) AB18.BB2(-15V) AB19.AB2(-15V) AB19.BB2(-15V) AB20.AB2(-15V) AB20.BB2(-15V)
GND: AB17.AC2(GND) AB17.AT1(GND) AB17.BC2(GND) AB17.BT1(GND) AB18.AC2(GND) AB18.AT1(GND) AB18.BC2(GND) AB18.BT1(GND) AB19.AC2(GND) AB19.AT1(GND) AB19.BC2(GND) AB19.BT1(GND) AB20.AC2(GND) AB20.AT1(GND) AB20.BC2(GND) AB20.BT1(GND) C16.A1 C16.C1 C16.C2 C16.F1 C16.F2 C16.J2 C16.K1 C16.L2 C16.N1 C16.N2 C16.R1 C16.R2 C16.T1 C16.U2 C17.A1 C17.C1 C17.C2 C17.F1 C17.F2 C17.J2 C17.K1 C17.L2 C17.N1 C17.N2 C17.R1 C17.R2 C17.T1 C17.U2 C18.A1 C18.C1 C18.C2 C18.F1 C18.F2 C18.J2 C18.K1 C18.L2 C18.N1 C18.N2 C18.R1 C18.R2 C18.T1 C18.U2 C19.A1 C19.C1 C19.C2 C19.F1 C19.F2 C19.J2 C19.K1 C19.L2 C19.N1 C19.N2 C19.R1 C19.R2 C19.T1 C19.U2 C20.A1 C20.C1 C20.C2 C20.F1 C20.F2 C20.J2 C20.K1 C20.L2 C20.N1 C20.N2 C20.R1 C20.R2 C20.T1 C20.U2 D16.A1 D16.C1 D16.C2 D16.F1 D16.F2 D16.J2 D16.K1 D16.L2 D16.N1 D16.N2 D16.R1 D16.R2 D16.T1 D16.U2 D17.A1 D17.C1 D17.C2 D17.F1 D17.F2 D17.J2 D17.K1 D17.L2 D17.N1 D17.N2 D17.R1 D17.R2 D17.T1 D17.U2 D18.A1 D18.C1 D18.C2 D18.F1 D18.F2 D18.J2 D18.K1 D18.L2 D18.N1 D18.N2 D18.R1 D18.R2 D18.T1 D18.U2 D19.A1 D19.C1 D19.C2 D19.F1 D19.F2 D19.J2 D19.K1 D19.L2 D19.N1 D19.N2 D19.R1 D19.R2 D19.T1 D19.U2 D20.A1 D20.C1 D20.C2 D20.F1 D20.F2 D20.J2 D20.K1 D20.L2 D20.N1 D20.N2 D20.R1 D20.R2 D20.T1 D20.U2
VCC: AB17.AA2(VCC) AB17.BA2(VCC) AB18.AA2(VCC) AB18.BA2(VCC) AB19.AA2(VCC) AB19.BA2(VCC) AB20.AA2(VCC) AB20.BA2(VCC)

## Library data of the parts
A07 B07 C07 D07 = dec-m:M916: Simple 36 pin connector/wire cable
AB17-AB20 = dec-m:M7102: Positive I/O Bus Converter
C16-C20 D16-D20 = dec-m:M903: Two-sided Posibus cable/connector.

## Net classes
1 Supply: width 0.762 mm